# Altium schematic sheet USB.SchDoc: USB
size A4; DocumentNumber: MB1137; Revision: B-01; SheetNumber: 4; SheetTotal: 6; Project: NUCLEO-XXXXZX
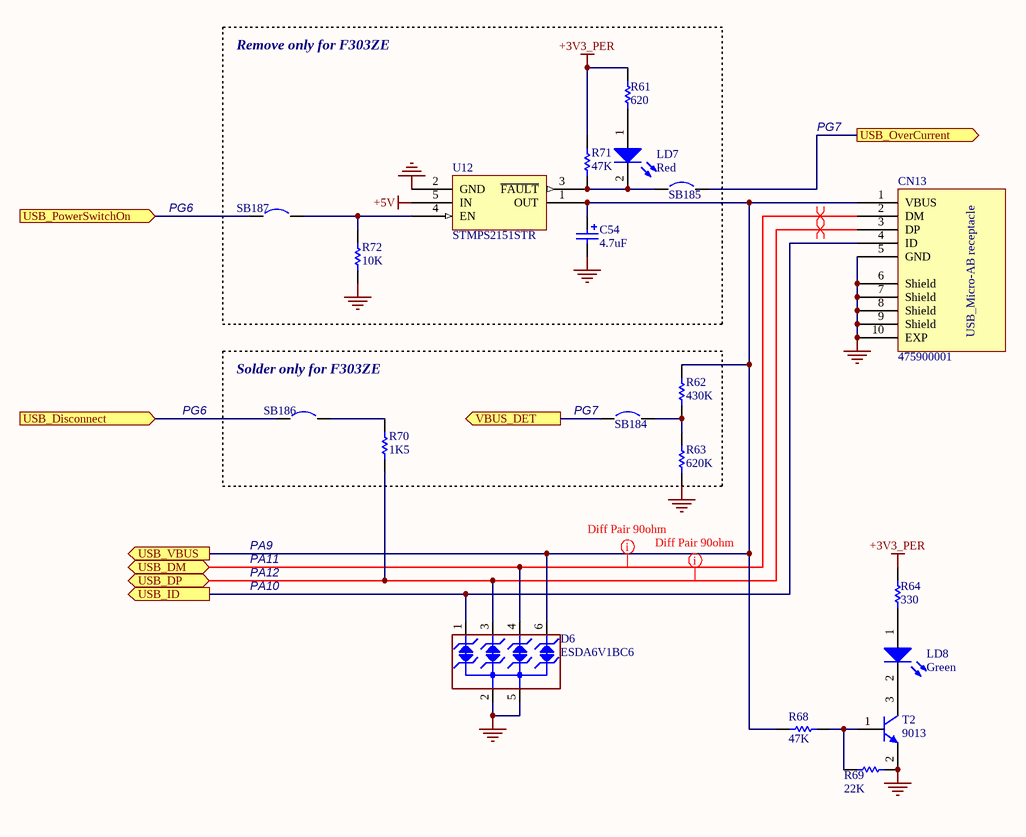
[diagram p0: USB.SchDoc]

## Parts
C54  4.7uF  [TAN-A]
CN13  475900001  [MOLEX_47590001]
D6  ESDA6V1BC6  [SOT23-6L]
LD7  Red  [0603D-R]
LD8  Green  [0603D-G]
R61  620  [0603R]
R62  430K  [0603R]
R63  620K  [0603R]
R64  330  [0603R]
R68  47K  [0603R]
R69  22K  [0603R]
R70  1K5  [0603R]
R71  47K  [0603R]
R72  10K  [0603R]
SB184  Circuit Breaker  [SB_0603]  (value not drawn)
SB185  Circuit Breaker  [SB_0603]  (value not drawn)
SB186  Circuit Breaker  [SB_0603]  (value not drawn)
SB187  Circuit Breaker  [SB_0603]  (value not drawn)
T2  9013  [SOT-23]
U12  STMPS2151STR  [SOT-23-5L]

## Blocks framed on the sheet
Remove only for F303ZE: C54 LD7 R61 R71 R72 SB185 SB187 U12
Solder only for F303ZE: R62 R63 R70 SB184 SB186

## Ports
USB_Disconnect (in), USB_DM (bidir), USB_DP (bidir), USB_ID (out), USB_OverCurrent (out), USB_PowerSwitchOn (in), USB_VBUS (out), VBUS_DET (out)

## Nets
+3V3_PER: R61.2 R64.2 R71.1
+5V: U12.5(IN)
GND: C54.2 CN13.5(GND) CN13.6(Shield) CN13.7(Shield) CN13.8(Shield) CN13.9(Shield) CN13.10(EXP) D6.2(IO2) D6.5(IO4) R63.2 R69.1 R72.1 T2.2(E) U12.2(GND)
USB_Disconnect: SB186.1 ; port USB_Disconnect
USB_DM: CN13.2(DM) D6.4(IO3) ; port USB_DM
USB_DP: CN13.3(DP) D6.3(GND) R70.1 ; port USB_DP
USB_ID: CN13.4(ID) D6.1(IO1) ; port USB_ID
USB_OverCurrent: SB185.2 ; port USB_OverCurrent
USB_PowerSwitchOn: SB187.1 ; port USB_PowerSwitchOn
USB_VBUS: C54.1 CN13.1(VBUS) D6.6(NC) R62.1 R68.1 U12.1(OUT) ; port USB_VBUS
VBUS_DET: SB184.1 ; port VBUS_DET
NetLD7_1: LD7.1(A) R61.1
NetLD7_2: LD7.2(K) R71.2 SB185.1 U12.3(~{FAULT})
NetLD8_1: LD8.1(A) R64.1
NetLD8_2: LD8.2(K) T2.3(C)
NetR62_2: R62.2 R63.1 SB184.2
NetR68_2: R68.2 R69.2 T2.1(B)
NetR70_2: R70.2 SB186.2
NetR72_2: R72.2 SB187.2 U12.4(EN)

## Layout directives
mark named Diff Pair 90ohm: USB_DM, USB_DP
differential pair: USB_DM, USB_DP

## Notes on the sheet
- PG7
- PG6
- (near SB184) PG7
- PA9
- PA12
- PA11
- PA10
- Title:
- Project:
- Size:
- Date:
- A4
- Reference:
- Sheet:
- Revision:
- of
- (in symbol 475900001) USB_Micro-AB receptacle

## Library data of the parts
C54 = Cap Pol1: Polarized Capacitor (Radial); Value: 47uF; Published: 8-Jun-2000; Revision: July-2002: Re-released for DXP Platform.; Publisher: Altium Limited
D6 = ESDA6V1BC6: 4-line ESD protection; Manuf_1: STM; Manuf_Part_1: ESDA5V3L; Ref St: 9179034; Provided: ST; ECCN_US/EU: EAR99/NEC; Distrib: ST; Order: ESDA5V3L; Ordered by: STM
LD7 LD8 = LED2: Typical RED, GREEN, YELLOW, AMBER GaAs LED; Published: 8-Jun-2000; Revision: July-2002: Re-released for DXP Platform.; Publisher: Altium Limited
R61 R72 = Res1: Resistor; Value: 1K; Published: 8-Jun-2000; Revision: July-2002: Re-released for DXP Platform.; Publisher: Altium Limited
R62-R64 R68 R69 R71 = res1: Resistor; Value: 1K; Published: 8-Jun-2000; Revision: July-2002: Re-released for DXP Platform.; Publisher: Altium Limited
R70 = Resistor_ST: Resistor 0402 / 0603 / 0805; Value: 10K
SB184-SB187 = Circuit Breaker: Solder: NO; Published: 24-Mar-1999; Revision: July-2002: Re-released for DXP Platform.; Publisher: Altium Limited
T2 = NPN: NPN Bipolar Transistor; Code - JEDEC: TO-226-AA; Published: 8-Jun-2000; Revision: July-2002: Re-released for DXP Platform.; Publisher: Altium Limited
U12 = STMPS2141STR